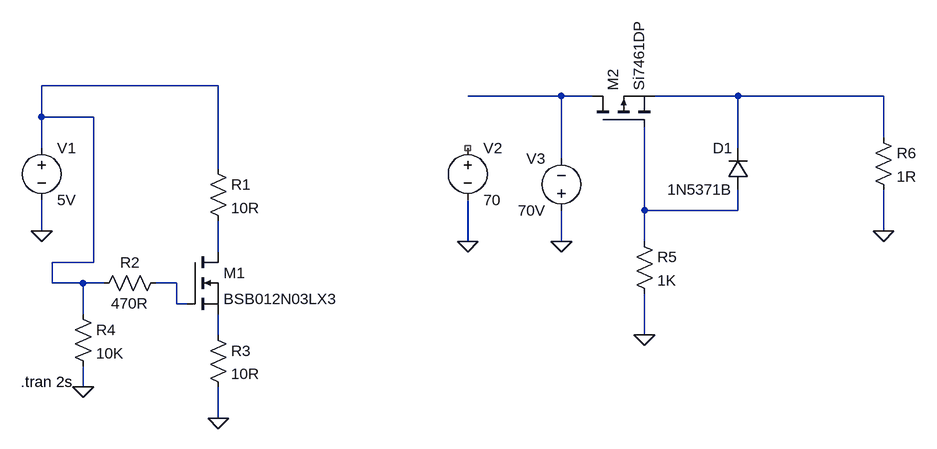
[diagram p0: schematic Draft1.asc]
Draft1.asc, the LTspice schematic file:
Version 4.1
SHEET 1 1348 680
WIRE 256 -112 -16 -112
WIRE 784 -96 640 -96
WIRE 832 -96 784 -96
WIRE 1056 -96 928 -96
WIRE 1280 -96 1056 -96
WIRE -16 -64 -16 -112
WIRE 64 -64 -16 -64
WIRE 1280 -32 1280 -96
WIRE -16 -16 -16 -64
WIRE 1056 -16 1056 -96
WIRE 784 0 784 -96
WIRE 256 16 256 -112
WIRE 912 80 912 -48
WIRE 1056 80 1056 48
WIRE 1056 80 912 80
WIRE -16 112 -16 64
WIRE 1280 112 1280 48
WIRE 640 128 640 64
WIRE 784 128 784 80
WIRE 912 128 912 80
WIRE 256 144 256 96
WIRE 64 160 64 -64
WIRE 64 160 0 160
WIRE 0 192 0 160
WIRE 48 192 0 192
WIRE 80 192 48 192
WIRE 192 192 160 192
WIRE 192 224 192 192
WIRE 208 224 192 224
WIRE 48 240 48 192
WIRE 256 272 256 240
WIRE 912 272 912 208
WIRE 48 352 48 320
WIRE 256 400 256 352
FLAG 256 400 0
FLAG -16 112 0
FLAG 48 352 0
FLAG 640 128 0
FLAG 912 272 0
FLAG 1280 112 0
FLAG 784 128 0
SYMBOL voltage -16 -32 R0
WINDOW 123 0 0 Left 0
WINDOW 39 0 0 Left 0
SYMATTR InstName V1
SYMATTR Value 5V
SYMBOL res 176 176 R90
WINDOW 0 0 56 VBottom 2
WINDOW 3 32 56 VTop 2
SYMATTR InstName R2
SYMATTR Value 470R
SYMBOL res 240 0 R0
SYMATTR InstName R1
SYMATTR Value 10R
SYMBOL res 32 224 R0
SYMATTR InstName R4
SYMATTR Value 10K
SYMBOL nmos 208 144 R0
SYMATTR InstName M1
SYMATTR Value BSB012N03LX3
SYMBOL res 240 256 R0
SYMATTR InstName R3
SYMATTR Value 10R
SYMBOL voltage 640 -32 R0
WINDOW 123 0 0 Left 0
WINDOW 39 0 0 Left 0
SYMATTR InstName V2
SYMATTR Value 70
SYMBOL pmos 832 -48 R270
SYMATTR InstName M2
SYMATTR Value Si7461DP
SYMBOL res 896 112 R0
SYMATTR InstName R5
SYMATTR Value 1K
SYMBOL res 1264 -48 R0
SYMATTR InstName R6
SYMATTR Value 1R
SYMBOL diode 1072 48 R180
WINDOW 0 24 64 Left 2
WINDOW 3 24 0 Left 2
SYMATTR InstName D1
SYMATTR Value 1N5371B
SYMATTR Description Diode
SYMATTR Type diode
SYMBOL voltage 784 96 R180
WINDOW 0 24 96 Left 2
WINDOW 3 24 16 Left 2
WINDOW 123 0 0 Left 0
WINDOW 39 0 0 Left 0
SYMATTR InstName V3
SYMATTR Value 70V
TEXT -48 344 Left 2 !.tran 2s

The netlist it stands for:
* Draft1.asc
V1 N001 0 5V
R2 N006 N001 470R
R1 N001 N005 10R
R4 N001 0 10K
M1 N005 N006 N007 N007 BSB012N03LX3
R3 N007 0 10R
V2 NC_01 0 70
M2 N002 N004 N003 N003 Si7461DP
R5 N004 0 1K
R6 N003 0 1R
D1 N004 N003 1N5371B
V3 0 N002 70V
.model D D
.lib standard.dio
.model NMOS NMOS
.model PMOS PMOS
.lib standard.mos
.tran 2s
.backanno
.end